# Altium project testjig-v1.PrjPcb
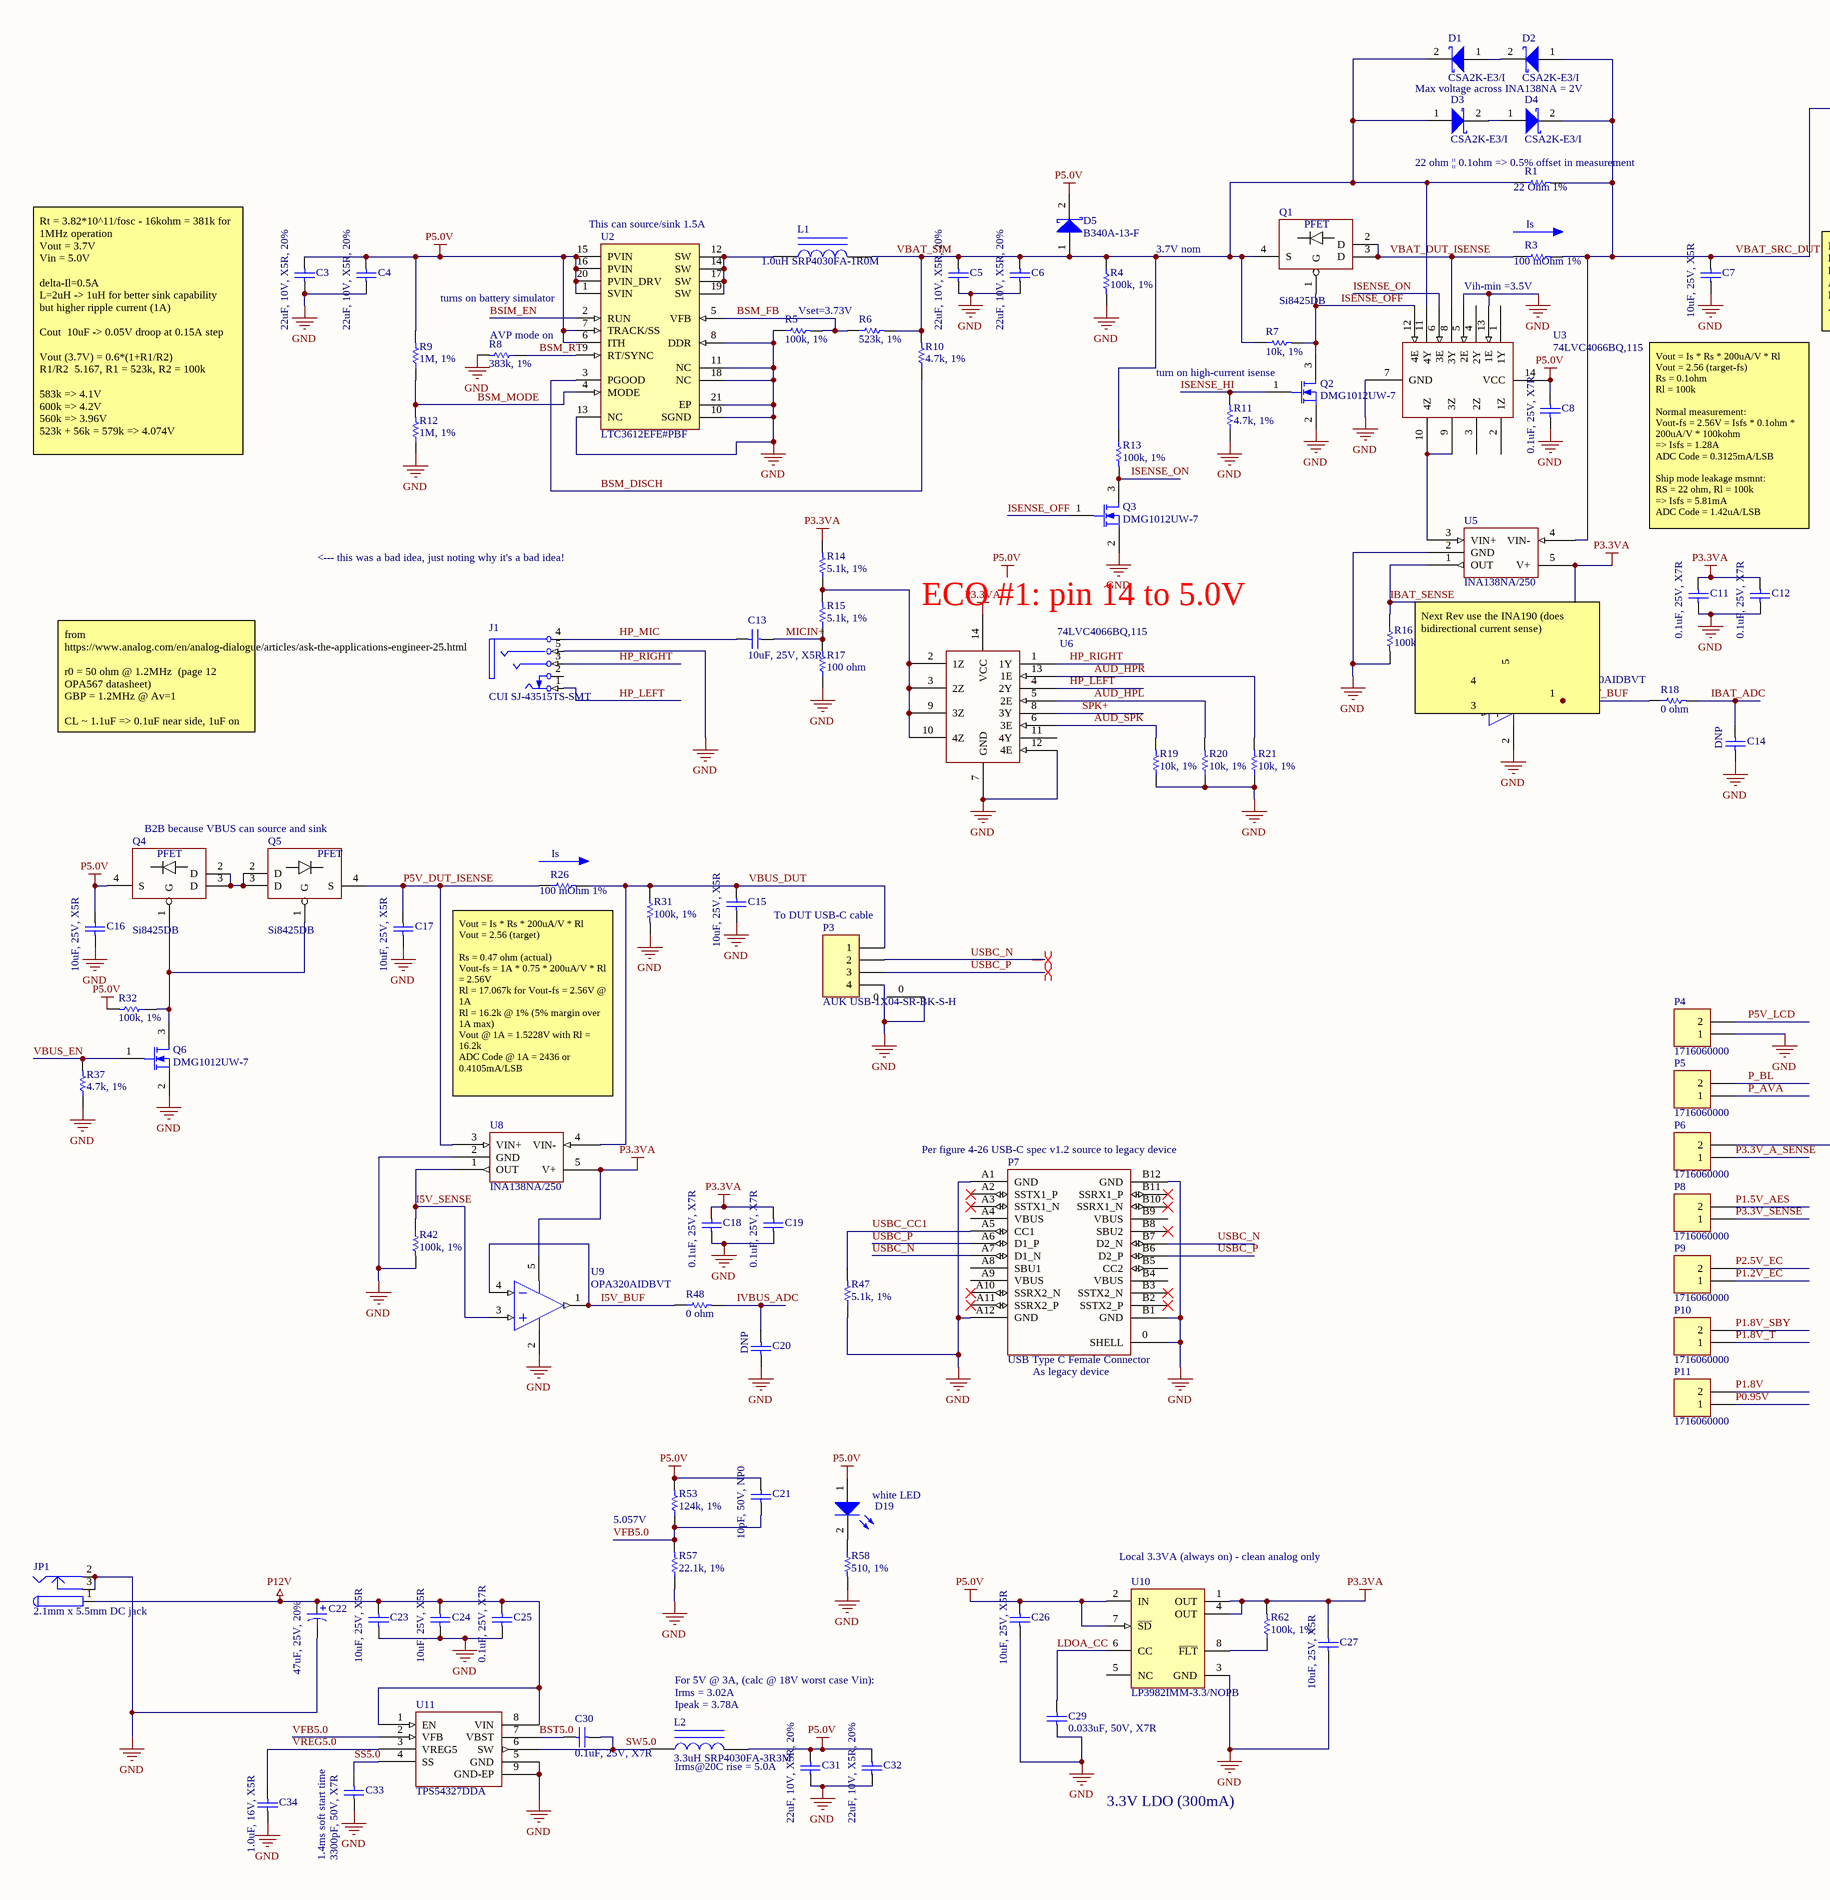
[diagram p0: testcore.SchDoc, left]
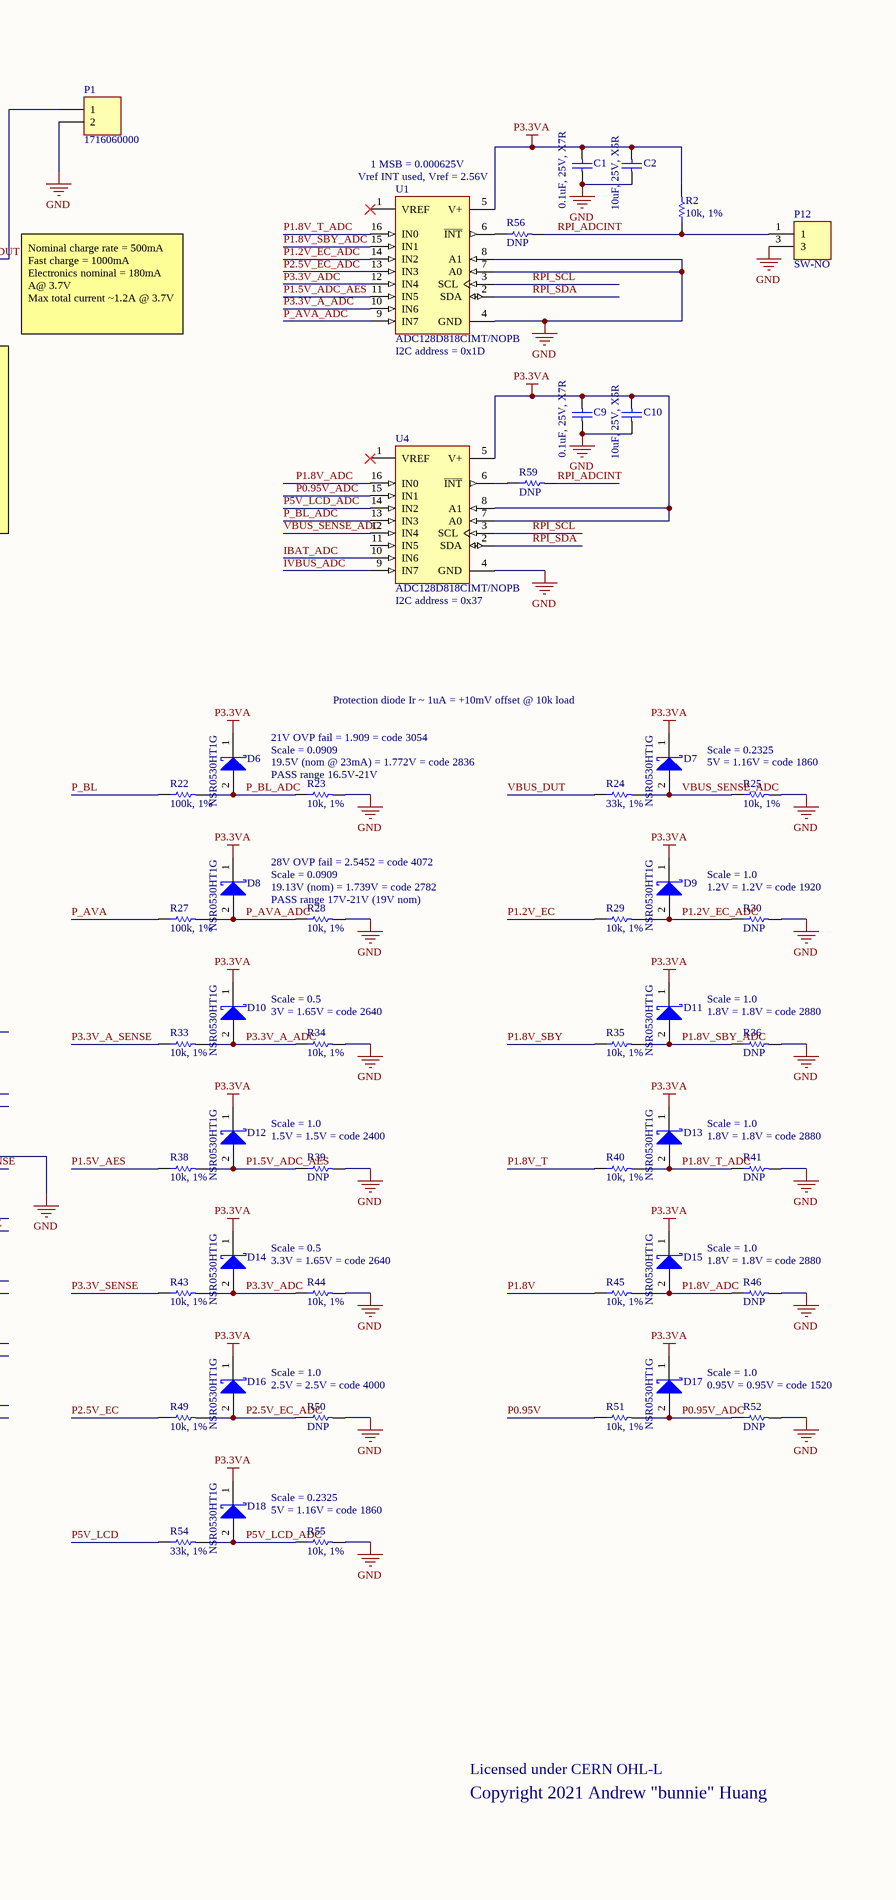
[diagram p1: testcore.SchDoc, right]
2 sheets, 192 parts. Net scope: global (net labels, ports and power ports of the same name join across sheets).
Board file: testjig-v1.PCBDOC
Sheets:
  testcore.SchDoc
  interfaces.SchDoc

## Sheet testcore.SchDoc
size A2

### Parts
C1  0.1uF, 25V, X7R  [B_CAP0603]
C2  10uF, 25V, X5R  [B_CAP0805]
C3  22uF, 10V, X5R, 20%  [B_CAP0805]
C4  22uF, 10V, X5R, 20%  [B_CAP0805]
C5  22uF, 10V, X5R, 20%  [B_CAP0805]
C6  22uF, 10V, X5R, 20%  [B_CAP0805]
C7  10uF, 25V, X5R  [B_CAP0805]
C8  0.1uF, 25V, X7R  [B_CAP0603]
C9  0.1uF, 25V, X7R  [B_CAP0603]
C10  10uF, 25V, X5R  [B_CAP0805]
C11  0.1uF, 25V, X7R  [B_CAP0603]
C12  0.1uF, 25V, X7R  [B_CAP0603]
C13  10uF, 25V, X5R  [B_CAP0805]
C14  DNP  [B_CAP0603]
C15  10uF, 25V, X5R  [B_CAP0805]
C16  10uF, 25V, X5R  [B_CAP0805]
C17  10uF, 25V, X5R  [B_CAP0805]
C18  0.1uF, 25V, X7R  [B_CAP0603]
C19  0.1uF, 25V, X7R  [B_CAP0603]
C20  DNP  [B_CAP0603]
C21  10pF, 50V, NP0  [B_CAP0603]
C22  47uF, 25V, 20%  [CAPAE7066X61N]
C23  10uF, 25V, X5R  [B_CAP0805]
C24  10uF, 25V, X5R  [B_CAP0805]
C25  0.1uF, 25V, X7R  [B_CAP0603]
C26  10uF, 25V, X5R  [B_CAP0805]
C27  10uF, 25V, X5R  [B_CAP0805]
C29  0.033uF, 50V, X7R  [B_CAP0603]
C30  0.1uF, 25V, X7R  [B_CAP0603]
C31  22uF, 10V, X5R, 20%  [B_CAP0805]
C32  22uF, 10V, X5R, 20%  [B_CAP0805]
C33  3300pF, 50V, X7R  [B_CAP0603]
C34  1.0uF, 16V, X5R  [B_CAP0603]
D1  CSA2K-E3/I  [DSO-C2/X1.8]
D2  CSA2K-E3/I  [DSO-C2/X1.8]
D3  CSA2K-E3/I  [DSO-C2/X1.8]
D4  CSA2K-E3/I  [DSO-C2/X1.8]
D5  B340A-13-F  [DSO-C2/X1.8]
D6  NSR0530HT1G  [SOD-323]
D7  NSR0530HT1G  [SOD-323]
D8  NSR0530HT1G  [SOD-323]
D9  NSR0530HT1G  [SOD-323]
D10  NSR0530HT1G  [SOD-323]
D11  NSR0530HT1G  [SOD-323]
D12  NSR0530HT1G  [SOD-323]
D13  NSR0530HT1G  [SOD-323]
D14  NSR0530HT1G  [SOD-323]
D15  NSR0530HT1G  [SOD-323]
D16  NSR0530HT1G  [SOD-323]
D17  NSR0530HT1G  [SOD-323]
D18  NSR0530HT1G  [SOD-323]
D19  white LED  [B_LED0805]
J1  CUI SJ-43515TS-SMT  [CUI_SJ_43515TS-SMT]
JP1  2.1mm x 5.5mm DC jack  [CUI_PJ_002AH_SMT]
L1  1.0uH SRP4030FA-1R0M  [COILCRAFT_XEL4030]
L2  3.3uH SRP4030FA-3R3M  [COILCRAFT_XEL4030]
P1  1716060000  [weidmuller_1716060000]
P3  AUK USB-1X04-SR-BK-S-H  [USB_TYPEA_TH_SINGLE]
P4  1716060000  [weidmuller_1716060000]
P5  1716060000  [weidmuller_1716060000]
P6  1716060000  [weidmuller_1716060000]
P7  USB Type C Female Connector  [HIROSE_CX90B1-24P]
P8  1716060000  [weidmuller_1716060000]
P9  1716060000  [weidmuller_1716060000]
P10  1716060000  [weidmuller_1716060000]
P11  1716060000  [weidmuller_1716060000]
P12  SW-NO  [CK_KS11R22CQD]
Q1  Si8425DB  [VISHAY_MICRO_FOOT_4_BUMP]
Q2  DMG1012UW-7  [SOT323-3AN]
Q3  DMG1012UW-7  [SOT323-3AN]
Q4  Si8425DB  [VISHAY_MICRO_FOOT_4_BUMP]
Q5  Si8425DB  [VISHAY_MICRO_FOOT_4_BUMP]
Q6  DMG1012UW-7  [SOT323-3AN]
R1  22 Ohm 1%  [B_RES1206]
R2  10k, 1%  [B_RES0603]
R3  100 mOhm 1%  [B_RES1206]
R4  100k, 1%  [B_RES0603]
R5  100k, 1%  [B_RES0603]
R6  523k, 1%  [B_RES0603]
R7  10k, 1%  [B_RES0603]
R8  383k, 1%  [B_RES0603]
R9  1M, 1%  [B_RES0603]
R10  4.7k, 1%  [B_RES0603]
R11  4.7k, 1%  [B_RES0603]
R12  1M, 1%  [B_RES0603]
R13  100k, 1%  [B_RES0603]
R14  5.1k, 1%  [B_RES0603]
R15  5.1k, 1%  [B_RES0603]
R16  100k, 1%  [B_RES0603]
R17  100 ohm  [B_RES0603]
R18  0 ohm  [B_RES0603]
R19  10k, 1%  [B_RES0603]
R20  10k, 1%  [B_RES0603]
R21  10k, 1%  [B_RES0603]
R22  100k, 1%  [B_RES0603]
R23  10k, 1%  [B_RES0603]
R24  33k, 1%  [B_RES0603]
R25  10k, 1%  [B_RES0603]
R26  100 mOhm 1%  [B_RES1206]
R27  100k, 1%  [B_RES0603]
R28  10k, 1%  [B_RES0603]
R29  10k, 1%  [B_RES0603]
R30  DNP  [B_RES0603]
R31  100k, 1%  [B_RES0603]
R32  100k, 1%  [B_RES0603]
R33  10k, 1%  [B_RES0603]
R34  10k, 1%  [B_RES0603]
R35  10k, 1%  [B_RES0603]
R36  DNP  [B_RES0603]
R37  4.7k, 1%  [B_RES0603]
R38  10k, 1%  [B_RES0603]
R39  DNP  [B_RES0603]
R40  10k, 1%  [B_RES0603]
R41  DNP  [B_RES0603]
R42  100k, 1%  [B_RES0603]
R43  10k, 1%  [B_RES0603]
R44  10k, 1%  [B_RES0603]
R45  10k, 1%  [B_RES0603]
R46  DNP  [B_RES0603]
R47  5.1k, 1%  [B_RES0603]
R48  0 ohm  [B_RES0603]
R49  10k, 1%  [B_RES0603]
R50  DNP  [B_RES0603]
R51  10k, 1%  [B_RES0603]
R52  DNP  [B_RES0603]
R53  124k, 1%  [B_RES0603]
R54  33k, 1%  [B_RES0603]
R55  10k, 1%  [B_RES0603]
R56  DNP  [B_RES0603]
R57  22.1k, 1%  [B_RES0603]
R58  510, 1%  [B_RES0603]
R59  DNP  [B_RES0603]
R62  100k, 1%  [B_RES0603]
U1  ADC128D818CIMT/NOPB  [MTC16_N]
U2  LTC3612EFE#PBF  [LT-FE-20-EPV-CB_L]
U3  74LVC4066BQ,115  [NXP_DHVQFN14]
U4  ADC128D818CIMT/NOPB  [MTC16_N]
U5  INA138NA/250  [SOT23-5AN]
U6  74LVC4066BQ,115  [NXP_DHVQFN14]
U7  OPA320AIDBVT  [TI-DBV5_N]
U8  INA138NA/250  [SOT23-5AN]
U9  OPA320AIDBVT  [TI-DBV5_N]
U10  LP3982IMM-3.3/NOPB  [MUA08A_N]
U11  TPS54327DDA  [SOIC127P600-8DN]

### Nets
GND: C1.2 C2.2 C3.2 C4.2 C5.2 C6.2 C7.1 C8.2 C9.2 C10.2 C11.2 C12.2 C14.2 C15.1 C16.1 C17.1 C18.2 C19.2 C20.2 C22.2 C23.1 C24.1 C25.2 C26.2 C27.2 C29.1 C31.2 C32.2 C33.2 C34.2 J1.5(R) JP1.2 JP1.3 P1.2 P3.0 P3.4 P4.1 P6.2 P7.0(SHELL) P7.A1(GND) P7.A12(GND) P7.B1(GND) P7.B12(GND) P12.3 Q2.2(S) Q3.2(S) Q6.2(S) R4.2 R5.1 R8.2 R11.1 R12.1 R16.2 R17.1 R19.1 R20.1 R21.1 R23.2 R25.2 R28.2 R30.2 R31.2 R34.2 R36.2 R37.1 R39.2 R41.2 R42.2 R44.2 R46.2 R47.1 R50.2 R52.2 R55.2 R57.1 R58.2 U1.4(GND) U1.7(A0) U1.8(A1) U2.8(DDR) U2.10(SGND) U2.11(NC) U2.13(NC) U2.18(NC) U2.21(EP) U3.5(2E) U3.7(GND) U3.13(1E) U4.4(GND) U5.2(GND) U6.7(GND) U6.12(4E) U7.2(V-) U8.2(GND) U9.2(V-) U10.3(GND) U11.5(GND) U11.9(GND-EP)
P1.8V: P11.2 R45.1
P1.8V_T: P10.1 R40.1
P3.3VA: C1.1 C2.1 C9.1 C10.1 C11.1 C12.1 C18.1 C19.1 C27.1 D6.1(K) D7.1(K) D8.1(K) D9.1(K) D10.1(K) D11.1(K) D12.1(K) D13.1(K) D14.1(K) D15.1(K) D16.1(K) D17.1(K) D18.1(K) R2.2 R14.2 R62.2 U1.5(V+) U4.5(V+) U4.7(A0) U4.8(A1) U5.5(V+) U6.14(VCC) U7.5(V+) U8.5(V+) U9.5(V+) U10.1(OUT) U10.4(OUT)
P5.0V: C3.1 C4.1 C8.1 C16.2 C21.1 C26.1 C31.1 C32.1 D5.2(K) D19.1(A) L2.2 Q4.4(S) R9.2 R32.2 R53.2 U2.1(SVIN) U2.6(ITH) U2.7(TRACK/SS) U2.15(PVIN) U2.16(PVIN) U2.20(PVIN_DRV) U3.14(VCC) U10.2(IN) U10.7(~{SD})
P12V: C22.1 C23.2 C24.2 C25.1 JP1.1 U11.1(EN) U11.8(VIN)
AUD_HPL: R20.2 U6.5(2E)
AUD_HPR: R21.2 U6.13(1E)
AUD_SPK: R19.2 U6.6(3E)
BSIM_EN: U2.2(RUN)
BSM_DISCH: R10.1 U2.3(PGOOD)
BSM_FB: R5.2 R6.1 U2.5(VFB)
BSM_MODE: R9.1 R12.2 U2.4(MODE)
BSM_RT: R8.1 U2.9(RT/SYNC)
BST5.0: C30.2 U11.7(VBST)
HP_LEFT: J1.1(T) U6.4(2Y)
HP_MIC: C13.2 J1.4(S)
HP_RIGHT: J1.3(R) U6.1(1Y)
I5V_BUF: R48.1 U9.1(OUT) U9.4(IN-)
I5V_SENSE: R42.1 U8.1(OUT) U9.3(IN+)
IBAT_ADC: C14.1 R18.2 U4.10(IN6)
IBAT_BUF: R18.1 U7.1(OUT) U7.4(IN-)
IBAT_SENSE: R16.1 U5.1(OUT) U7.3(IN+)
ISENSE_HI: Q2.1(G) R11.2
ISENSE_OFF: Q1.1(G) Q2.3(D) Q3.1(G) R7.2 U3.12(4E)
ISENSE_ON: Q3.3(D) R13.2 U3.6(3E)
IVBUS_ADC: C20.1 R48.2 U4.9(IN7)
LDOA_CC: C29.2 U10.6(CC)
MICIN+: C13.1 R15.1 R17.2
P0.95V: P11.1 R51.1
P0.95V_ADC: D17.2(A) R51.2 R52.1 U4.15(IN1)
P1.2V_EC: P9.1 R29.1
P1.2V_EC_ADC: D9.2(A) R29.2 R30.1 U1.14(IN2)
P1.5V_ADC_AES: D12.2(A) R38.2 R39.1 U1.11(IN5)
P1.5V_AES: P8.2 R38.1
P1.8V_ADC: D15.2(A) R45.2 R46.1 U4.16(IN0)
P1.8V_SBY: P10.2 R35.1
P1.8V_SBY_ADC: D11.2(A) R35.2 R36.1 U1.15(IN1)
P1.8V_T_ADC: D13.2(A) R40.2 R41.1 U1.16(IN0)
P2.5V_EC: P9.2 R49.1
P2.5V_EC_ADC: D16.2(A) R49.2 R50.1 U1.13(IN3)
P3.3V_A_ADC: D10.2(A) R33.2 R34.1 U1.10(IN6)
P3.3V_A_SENSE: P6.1 R33.1
P3.3V_ADC: D14.2(A) R43.2 R44.1 U1.12(IN4)
P3.3V_SENSE: P8.1 R43.1
P5V_DUT_ISENSE: C17.2 Q5.4(S) R26.1 U8.3(VIN+)
P5V_LCD: P4.2 R54.1
P5V_LCD_ADC: D18.2(A) R54.2 R55.1 U4.14(IN2)
P_AVA: P5.1 R27.1
P_AVA_ADC: D8.2(A) R27.2 R28.1 U1.9(IN7)
P_BL: P5.2 R22.1
P_BL_ADC: D6.2(A) R22.2 R23.1 U4.13(IN3)
RPI_ADCINT: P12.1 R2.1 R56.2 R59.2
RPI_SCL: U1.3(SCL) U4.3(SCL)
RPI_SDA: U1.2(SDA) U4.2(SDA)
SPK+: U6.8(3Y)
SS5.0: C33.1 U11.4(SS)
SW5.0: C30.1 L2.1 U11.6(SW)
USBC_CC1: P7.A5(CC1) R47.2
USBC_N: P3.2 P7.A7(D1_N) P7.B7(D2_N)
USBC_P: P3.3 P7.A6(D1_P) P7.B6(D2_P)
VBAT_DUT_ISENSE: Q1.2(D) Q1.3(D) R3.1 U3.8(3Y)
VBAT_SIM: C5.1 C6.1 D1.2(K) D3.1(A) D5.1(A) L1.2 Q1.4(S) R1.1 R4.1 R6.2 R7.1 R10.2 R13.1 U3.11(4Y)
VBAT_SRC_DUT: C7.2 D2.1(A) D4.2(K) P1.1 R1.2 R3.2 U5.4(VIN-)
VBUS_DUT: C15.2 P3.1 R24.1 R26.2 R31.1 U8.4(VIN-)
VBUS_EN: Q6.1(G) R37.2
VBUS_SENSE_ADC: D7.2(A) R24.2 R25.1 U4.12(IN4)
VFB5.0: C21.2 R53.1 R57.2 U11.2(VFB)
VREG5.0: C34.1 U11.3(VREG5)
NetD1_1: D1.1(A) D2.2(K)
NetD3_2: D3.2(K) D4.1(A)
NetD19_2: D19.2(K) R58.1
NetL1_1: L1.1 U2.12(SW) U2.14(SW) U2.17(SW) U2.19(SW)
NetQ4_1: Q4.1(G) Q5.1(G) Q6.3(D) R32.1
NetQ4_2: Q4.2(D) Q4.3(D) Q5.2(D) Q5.3(D)
NetR14_1: R14.1 R15.2 U6.2(1Z) U6.3(2Z) U6.9(3Z) U6.10(4Z)
NetR56_1: R56.1 U1.6(~{INT})
NetR59_1: R59.1 U4.6(~{INT})
NetR62_1: R62.1 U10.8(~{FLT})
NetU3_9: U3.9(3Z) U3.10(4Z) U5.3(VIN+)

Not connected (* = marked no-connect by the designer): J1 2(TN); P7 A2(SSTX1_P)* A3(SSTX1_N)* A4(VBUS) A8(SBU1) A9(VBUS) A10(SSRX2_N)* A11(SSRX2_P)* B2(SSTX2_P)* B3(SSTX2_N)* B4(VBUS) B5(CC2) B8(SBU2)* B9(VBUS) B10(SSRX1_N)* B11(SSRX1_P)*; U1 1(VREF)*; U3 1(1Y) 2(1Z) 3(2Z) 4(2Y); U4 1(VREF)* 11(IN5); U6 11(4Y); U10 5(NC)

### Layout directives
differential pair: USBC_N, USBC_P

### Notes on the sheet
- Max voltage across INA138NA = 2V
- (near R1) 22 ohm || 0.1ohm => 0.5% offset in measurement
- (near U1) Vref INT used, Vref = 2.56V
- (near U1) 1 MSB = 0.000625V
- (near U2) This can source/sink 1.5A
- 3.7V nom
- Is
- (near U2) turns on battery simulator
- (near R8) AVP mode on
- Vset=3.73V
- (near R3) Vih-min =3.5V
- Nominal charge rate = 500mA
  Fast charge = 1000mA
  Electronics nominal = 180mA A@ 3.7V
  Max total current ~1.2A @ 3.7V
- (near Q2) turn on high-current isense
- (near U1) I2C address = 0x1D
- Rt = 3.82*10^11/fosc - 16kohm = 381k for 1MHz operation
  Vout = 3.7V
  Vin = 5.0V
  delta-Il=0.5A
  L=2uH -> 1uH for better sink capability
  but higher ripple current (1A)
  Cout  10uF -> 0.05V droop at 0.15A step
  Vout (3.7V) = 0.6*(1+R1/R2)
  R1/R2  5.167, R1 = 523k, R2 = 100k
  583k => 4.1V
  600k => 4.2V
  560k => 3.96V
  523k + 56k = 579k => 4.074V
- Vout = Is * Rs * 200uA/V * Rl
  Vout = 2.56 (target-fs)
  Rs = 0.1ohm
  Rl = 100k
  Normal measurement:
  Vout-fs = 2.56V = Isfs * 0.1ohm * 200uA/V * 100kohm
  => Isfs = 1.28A
  ADC Code = 0.3125mA/LSB
  Ship mode leakage msmnt:
  RS = 22 ohm, Rl = 100k
  => Isfs = 5.81mA
  ADC Code = 1.42uA/LSB
- <--- this was a bad idea, just noting why it's a bad idea!
- ECO #1: pin 14 to 5.0V
- (near U4) I2C address = 0x37
- (near U7) Next Rev use the INA190 (does bidirectional current sense)
- Protection diode Ir ~ 1uA = +10mV offset @ 10k load
- from https://www.analog.com/en/analog-dialogue/articles/ask-the-applications-engineer-25.html
  r0 = 50 ohm @ 1.2MHz  (page 12 OPA567 datasheet)
  GBP = 1.2MHz @ Av=1
  CL ~ 1.1uF => 0.1uF near side, 1uF on Precursor
  fp = 1/(2pi*r0*CL) ~ 2895Hz
  10*(GBP/Anoise) < fp
  Anoise ~ 4144
  RF=10k, RG=10k, Asig = 2
  Anoise = 1 + Rf / (RG || RD) -> RG||RD = 2.41 ohm -> RD ~ 2.4 ohm
  CD ~ 2200uF
- Scale = 0.0909
- 19.5V (nom @ 23mA) = 1.772V = code 2836
- 21V OVP fail = 1.909 = code 3054
- (near R23) PASS range 16.5V-21V
- Scale = 0.2325
- 5V = 1.16V = code 1860
- B2B because VBUS can source and sink
- (near R26) Is
- 19.13V (nom) = 1.739V = code 2782
- 28V OVP fail = 2.5452 = code 4072
- (near R28) PASS range 17V-21V (19V nom)
- Scale = 1.0
- 1.2V = 1.2V = code 1920
- To DUT USB-C cable
- Scale = 0.5
- 3V = 1.65V = code 2640
- 1.8V = 1.8V = code 2880
- Vout = Is * Rs * 200uA/V * Rl
  Vout = 2.56 (target)
  Rs = 0.47 ohm (actual)
  Vout-fs = 1A * 0.75 * 200uA/V * Rl = 2.56V
  Rl = 17.067k for Vout-fs = 2.56V @ 1A
  Rl = 16.2k @ 1% (5% margin over 1A max)
  Vout @ 1A = 1.5228V with Rl = 16.2k
  ADC Code @ 1A = 2436 or 0.4105mA/LSB
- 1.5V = 1.5V = code 2400
- (near P7) Per figure 4-26 USB-C spec v1.2 source to legacy device
- 3.3V = 1.65V = code 2640
- (near P7) As legacy device
- 2.5V = 2.5V = code 4000
- 0.95V = 0.95V = code 1520
- 5.057V
- Local 3.3VA (always on) - clean analog only
- Irms = 3.02A
- For 5V @ 3A, (calc @ 18V worst case Vin):
- (near L2) Ipeak = 3.78A
- Licensed under CERN OHL-L
- (near L2) Irms@20C rise = 5.0A
- 3.3V LDO (300mA)
- Copyright 2021 Andrew "bunnie" Huang
- (near C33) 1.4ms soft start time
- Labels drawn without touching a wire or pin: P5.0V
- (in symbol Si8425DB) PFET

### Library data of the parts
C1 C8 C9 C11 C12 C18 C19 C25 C30 = Cap Semi: Capacitor (Semiconductor SIM Model); MPN: CC0603KRX7R8BB104; VENDOR: Murata; MYPN: C-104-25-X7R-0603
C2 C7 C10 C13 C15-C17 C23 C24 C26 C27 = Cap Semi: Capacitor (Semiconductor SIM Model); MPN: GRM21BR61E106KA73L; VENDOR: Murata; MYPN: C-106-25-X5R-0805
C3-C6 C31 C32 = Cap Semi: Capacitor (Semiconductor SIM Model); MPN: GRM21BR61A226ME51L; MFG: Murata; MYPN: C-226-10-X5R-0805; Published: 8-Jun-2000; LatestRevisionDate: 17-Jul-2002; LatestRevisionNote: Re-released for DXP Platform.; PackageReference: C1206; Publisher: Altium Limited
C14 C20 = Cap Semi: Capacitor (Semiconductor SIM Model); VENDOR: None; MPN: DNP; MYPN: DNP
C21 = Cap Semi: Capacitor (Semiconductor SIM Model); MPN: CL10C100JB8NFNC; VENDOR: Samsung; MYPN: C-100-50-NP0-0603
C22 = Cap Pol1: Polarized Capacitor (Radial); MPN: UCL1E470MCL1GS; VENDOR: Nichicon; MYPN: C-476-25-UCL-6.3x5.8
C29 = Cap Semi: Capacitor (Semiconductor SIM Model); MPN: CL10B333KB8NNNC; VENDOR: Samsung; MYPN: C-333-50-X7R-0603
C33 = Cap Semi: Capacitor (Semiconductor SIM Model); MPN: CL10B332KB8NNNC; VENDOR: Samsung; MYPN: C-332-50-X7R-0603
C34 = Cap Semi: Capacitor (Semiconductor SIM Model); MPN: CL10B105MO8NNWC; VENDOR: Samsung; MYPN: C-105-16-X5R-0603
D1-D4 = D Schottky: Schottky Diode; VENDOR: Vishay; MYPN: D-S-2-800-0p9-SMA; Revision: July-2002: Re-released for DXP Platform.; MPN: CSA2K-E3/I
D5 = D Schottky: Schottky Diode; VENDOR: Diodes Inc; MYPN: D-S-3-40-0p5-SMA; Revision: July-2002: Re-released for DXP Platform.; MPN: B340A-13-F
D6-D18 = D Schottky: Schottky Diode; MPN: NSR0530H-D; VENDOR: Semtech HK LTD; MYPN: D-S-0p5-30-0p37-SOD323; Revision: July-2002: Re-released for DXP Platform.
D19 = LED2: Typical RED, GREEN, YELLOW, AMBER GaAs LED; MPN: IN-S85AT5UW; VENDOR: Inolux; MYPN: D-LED-WHITE1-0805
J1 = Phonejack4 TN: Jack Socket, 3.5mm, SMT, 4-conductor; PackageDocument: 2003; PCB_Layout: Complies with manufacturer's recommendation.; DrillAndSlotSize: Corresponds to nominal value.; Published: 15-Jul-2004; DatasheetDocument: 2003; PackageReference: S1VS_SSB; Publisher: Altium Limited; ComponentLink1Description: Manufacturer Link; ComponentLink1URL: http://www.cliffuk.co.uk/; MPN: SJ-43515TS-SMT; VENDOR: CUI; MYPN: SJ-43515TS-SMT
JP1 = PWR2.5: Low Voltage Power Supply Connector; MPN: DC-480-2.0A-SMT; MYPN: J-PJ-002AH-SMT-TR; VENDOR: KAWEEI; Published: 17-Dec-2003; Datasheet: Latest Revision: 09-May-2002; Publisher: Altium Limited
L1 = Inductor Iron: Magnetic-Core Inductor; VENDOR: Bourns, Inc; MYPN: L-XEL4030-332ME_; MPN: SRP4030FA-1R0M
L2 = Inductor Iron: Magnetic-Core Inductor; MPN: XEL4030-332ME_; VENDOR: COILCRAFT; MYPN: L-XEL4030-332ME_
P1 P4-P6 P8-P11 = Header 2: Header, 2-Pin; VENDOR: Weidmuller; MYPN: J-TB-2P-5.08; LatestRevisionDate: 17-Jul-2002; LatestRevisionNote: Re-released for DXP Platform.; Publisher: Altium Limited; MPN: 1716060000
P3 = Header 4: Header, 4-Pin; LatestRevisionDate: 17-Jul-2002; LatestRevisionNote: Re-released for DXP Platform.; Publisher: Altium Limited
P7 = USB_TYPE_C: USB Type C Connector; MPN: 1-2295018-2; VENDOR: TE Connectivity AMP Connectors; MYPN: P-1-2295018-2
P12 = Header 2: Header, 2-Pin; LatestRevisionDate: 17-Jul-2002; LatestRevisionNote: Re-released for DXP Platform.; Publisher: Altium Limited
Q1 Q4 Q5 = Si8425DB: P-channel 20V 6.2A 27mOhm @ -2.5V; MPN: Si8425DB-T1-E1; VENDOR: Vishay Siliconix; MYPN: QSi8525
Q2 Q3 Q6 = MOSFET-N: N-Channel MOSFET; VENDOR: Diodes Inc; MYPN: Q-DMG1012UW-7; Published: 8-Jun-2000; LatestRevisionDate: 17-Jul-2002; LatestRevisionNote: Re-released for DXP Platform.; PackageVersion: 1995/1996; PackageReference: E3; Publisher: Altium Limited; MPN: DMG1012UW-7
R1 = Res1: Resistor; MPN: ERJ-8ENF22R0V; VENDOR: Panasonic; MYPN: R-220-1P-1_4W-1206
R2 R7 R19-R21 R23 R25 R28 R29 R33-R35 R38 R40 R43-R45 R49 R51 R55 = Res1: Resistor; MPN: RC0603FR-0710KL; VENDOR: Yageo; MYPN: R-103-1P-1_16W-0603
R3 R26 = Res1: Resistor; MPN: CSR1206FTR100; VENDOR: Stackpole; MYPN: R-0R100-1P-1_2W-1206
R4 R5 R13 R16 R22 R27 R31 R32 R42 R62 = Res1: Resistor; MPN: RC0603FR-07100KL; VENDOR: Yageo; MYPN: R-104-1P-1_16W-0603
R6 = Res1: Resistor; MPN: RC0603FR-07523KL; VENDOR: Yageo; MYPN: R-5233-1P-1_16W-0603
R8 = Res1: Resistor; MPN: RC0603FR-07383KL; VENDOR: Yageo; MYPN: R-3833-1P-1_16W-0402
R9 R12 = Res1: Resistor; MPN: RC0603FR-071ML; VENDOR: Yageo; MYPN: R-105-1P-1_16W-0603
R10 R11 R37 = Res1: Resistor; MPN: RC0603FR-074K7L; VENDOR: Yageo; MYPN: R-472-1P-1_16W-0603
R14 R15 R47 = Res1: Resistor; MPN: RC0603FR-075K1L; VENDOR: Yageo; MYPN: R-512-1P-1_16W-0603
R17 = Res1: Resistor; MPN: RC0603FR-07100RL; VENDOR: Yageo; MYPN: R-101-1P-1_16W-0603
R18 R48 = Res1: Resistor; MPN: RC0603JR-070RL; VENDOR: Yageo; MYPN: R-0R0-1P-1_16W-0603
R24 R54 = Res1: Resistor; MPN: RC0603FR-0733KL; VENDOR: Yageo; MYPN: R-333-1P-1_16W-0603
R30 R36 R39 R41 R46 R50 R52 R56 R59 = Res1: Resistor; VENDOR: ANY; MYPN: DNP; MPN: ANY
R53 = Res1: Resistor; MPN: RC0603FR-07124KL; VENDOR: Yageo; MYPN: R-1243-1P-1_16W-0603
R57 = Res1: Resistor; MPN: RC0603FR-0722K1L; VENDOR: Yageo; MYPN: R-2212-1P-1_16W-0603
R58 = Res1: Resistor; MPN: RC0603FR-07510RL; Value: 100k; VENDOR: Yageo; MYPN: R-511-1P-1_16W-0603; Published: 8-Jun-2000; LatestRevisionDate: 17-Jul-2002; LatestRevisionNote: Re-released for DXP Platform.; PackageReference: AXIAL-0.3; Publisher: Altium Limited
U1 U4 = ADC128D818CIMT/NOPB: 12-Bit, 8-Channel, ADC System Monitor with Temperature Sensor, Internal/External Reference, and I2C Interface, 16 pin TSSOP, Pb-Free; Manufacturer: National Semiconductor; PackageTopMarking: NSUZXYTT*128D818*CIMT; PowerWise: N; CompType: ADC IC; High-Reliability: Y; VENDOR: TI; MYPN: U-ADC128D818CIMT/NOPB; DatasheetVersion: Feb-2010; PackageVersion: revD, Jun-2003; PackageReference: MTC16; PackageDescription: Molded TSSOP, Jedec, 5 x 4.4 x 0.9mm Body, 16 Lead, 0.65mm Pitch; PartNumber: ADC128D818CIMT/NOPB; RoHS: Y; PinCount: 16; Code_JEDEC: MO-153-AB; ComponentLink1Description: ADC128D818 Datasheet; ComponentLink1URL: http://www.national.com/ds/AD/ADC128D818.pdf; ComponentLink2Description: ADC128D818 Web Page; ComponentLink2URL: http://www.national.com/pf/AD/ADC128D818.html; ComponentLink3Description: MTC16 Package Page; ComponentLink3URL: http://www.national.com/packaging/folders/mtc16.html; MPN: ADC128D818CIMT/NOPB
U2 = CMP-0492-00542-1: 3 A, 4 MHz Monolithic Synchronous Step-Down DC/DC Converter, 20-pin SOP (FE-20-EPV-CB), -40 to 125 degC, Pb-Free; Number of Outputs: 1; Frequency Adjust Range: Up - 4MHz; VENDOR: Linear Technology; PackageVersion: Rev. I, 05/2011; ComponentLink3URL: http://cds.linear.com/docs/en/packaging/05081663__J_FE20(CB).pdf; ComponentLink1URL: http://www.linear.com/; MPN: LTC3612EFE#PBF; ComponentLink2Description: Datasheet; DatasheetVersion: Rev. A; ComponentLink1Description: Manufacturer URL; RoHS: TRUE; Mounting Technology: Surface Mount; PackageDescription: 20-Pin Plastic TSSOP, Body 6.5 x 4.4 mm, Pitch 0.65 mm; ComponentLink3Description: Package Specification; ComponentLink2URL: http://cds.linear.com/docs/en/datasheet/3612fa.pdf; PackageReference: FE-20
U3 U6 = 74LVC4066: Quad Bilateral Switch; MYPN: U-74LVC4066; VENDOR: NXP; MPN: 74LVC4066BQ,115
U5 U8 = INA138NA/250: High-side measurement current shunt monitor; VENDOR: TI; MYPN: U-INA138NA/250; MPN: INA138NA/250
U7 U9 = OPA320AIDBVT: Precision, 20 MHz, 0.9 pA Ib, RRIO, CMOS Operational Amplifier, 1.8 to 5.5 V, -40 to 125 degC, 5-pin SOT23 (DBV5), Green (RoHS & no Sb/Br); Manufacturer: Texas Instruments; CMRR(Min)(dB): 100; IIB(Max)(pA): 0.9; Iq per channel(Max)(mA): 1.75; Number of Channels: 2; Offset Drift(Typ)(uV/C): 1.5; Slew Rate(Typ)(V/us): 10; Sub Family: High Output Current Amplifier (>=50mA), Low Input Bias Current Amp (<=10pA), Low Noise Amp (<=10nV/rtHz), Low Offset Voltage Amplifier (<=500uV), Low Supply Voltage Amplifier (<=2.7V), Precision Amplifier; Total Supply Voltage(Max)(+5V is 5, +/-5V is 10): 5.5; Total Supply Voltage(Min)(+5V is 5, +/-5V is 10): 1.8; Vio (25C)(Max)(mV): 0.15; Vn at 1kHz(Typ)(nV/rtHz): 8.5; MYPN: U-OPA320AIDBVT; VENDOR: TI; DatasheetVersion: SBOS513D; PackageVersion: 4073253-4/K, 03/2006; PackageReference: DBV5; PackageDescription: 5-Pin Plastic Small Outline, Body 1.6 x 2.9 mm, Pitch 0.95 mm; Supplier 1: Digi-Key; Supplier Part Number 1: 296-29510-2-ND; Supplier 2: Digi-Key; Supplier Part Number 2: 296-29510-1-ND; Supplier 3: Digi-Key; Supplier Part Number 3: 296-29510-6-ND; Supplier 4: Farnell; Supplier Part Number 4: 2057093; Supplier 5: Newark; Supplier Part Number 5: 64T3763; Supplier 6: Newark; Supplier Part Number 6: 64T3764; Supplier 7: Mouser; Supplier Part Number 7: 595-OPA320AIDBVT; Eco-Plan: Green (RoHS & no Sb/Br); Mounting Technology: Surface Mount; Code_JEDEC: MO-178; PartNumber: OPA320AIDBVT; ComponentLink1Description: Manufacturer URL; ComponentLink1URL: http://www.ti.com/; ComponentLink2Description: Datasheet; ComponentLink2URL: http://www.ti.com/general/docs/lit/getliterature.tsp?genericPartNumber=OPA320&fileType=pdf; ComponentLink3Description: Package Specification; ComponentLink3URL: http://www.ti.com/litv/pdf/mpds018i; MPN: OPA320AIDBVT
U10 = LP3982IMM-3.3/NOPB: Micropower, Ultra Low-Dropout, Low-Noise, 300mA CMOS Regulator, 8-pin Mini SOIC, Pb-Free; Manufacturer: National Semiconductor; PackageTopMarking: ZXTT*LEUB; PowerWise: N; CompType: LDO IC; High-Reliability: Y; MYPN: ULP3982IMM-3.3/NOPB; VENDOR: TI; DatasheetVersion: Mar-2006; PackageVersion: revF, Apr-2008; PackageReference: MUA08A; PackageDescription: MINI SOIC, .118 x .118 x .034in, 8 Lead, .0256in Pitch; PartNumber: LP3982IMM-3.3/NOPB; RoHS: Y; PinCount: 8; Code_JEDEC: MO-187-AA; ComponentLink1Description: Manufacturer URL; ComponentLink1URL: http://www.national.com/; ComponentLink2Description: LP3982 Datasheet; ComponentLink2URL: http://www.national.com/ds/LP/LP3982.pdf; ComponentLink3Description: LP3982 Web Page; ComponentLink3URL: http://www.national.com/pf/LP/LP3982.html; ComponentLink4Description: MUA08A Package Page; ComponentLink4URL: http://www.national.com/packaging/folders/mua08a.html; MPN: LP3982IMM-3.3/NOPB
U11 = TPS54327DDA: 3-A Output Single Synchronous Step-Down Buck with Integrated FET; MPN: TPS54327DDA(R); MYPN: U-TPS54327DDA; VENDOR: TI

## Sheet interfaces.SchDoc
size C
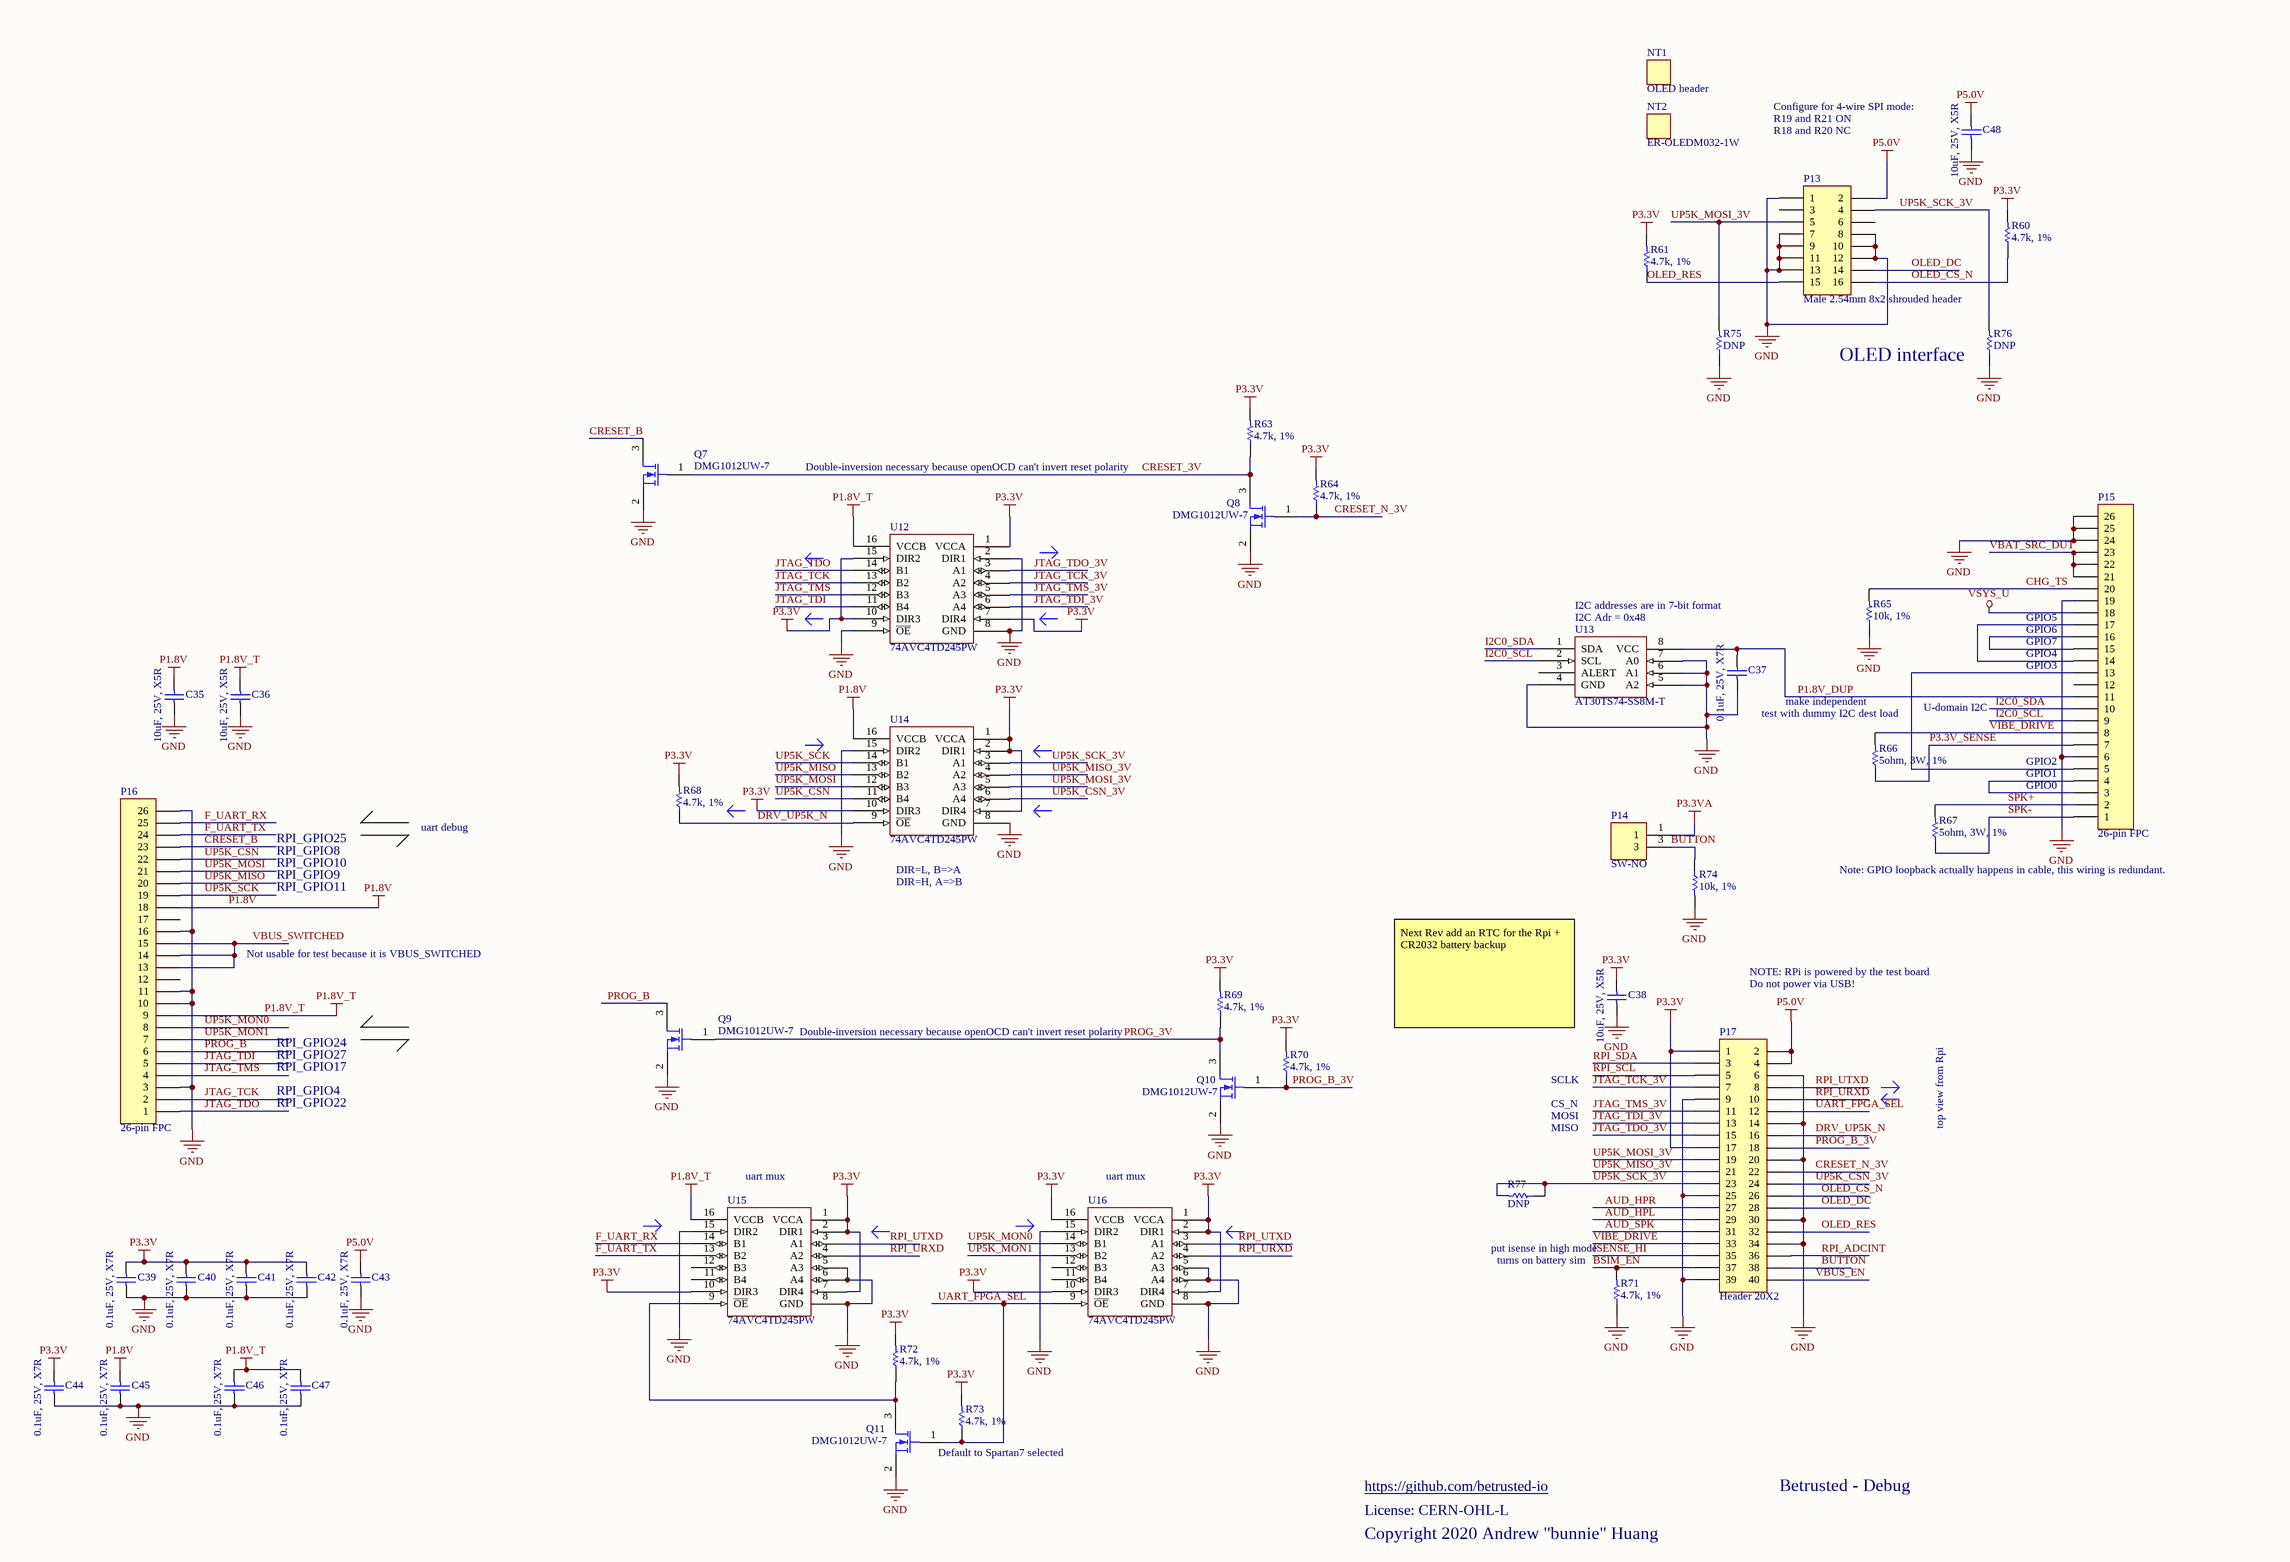
[diagram p2: interfaces.SchDoc]

### Parts
C35  10uF, 25V, X5R  [B_CAP0805]
C36  10uF, 25V, X5R  [B_CAP0805]
C37  0.1uF, 25V, X7R  [B_CAP0603]
C38  10uF, 25V, X5R  [B_CAP0805]
C39  0.1uF, 25V, X7R  [B_CAP0603]
C40  0.1uF, 25V, X7R  [B_CAP0603]
C41  0.1uF, 25V, X7R  [B_CAP0603]
C42  0.1uF, 25V, X7R  [B_CAP0603]
C43  0.1uF, 25V, X7R  [B_CAP0603]
C44  0.1uF, 25V, X7R  [B_CAP0603]
C45  0.1uF, 25V, X7R  [B_CAP0603]
C46  0.1uF, 25V, X7R  [B_CAP0603]
C47  0.1uF, 25V, X7R  [B_CAP0603]
C48  10uF, 25V, X5R  [B_CAP0805]
NT1  OLED header
NT2  ER-OLEDM032-1W
P13  Male 2.54mm 8x2 shrouded header  [ER_OLED_M032_1]
P14  SW-NO  [CK_KS11R22CQD]
P15  26-pin FPC  [HRS_FH34SRJ-26S-0.5SH(50)]
P16  26-pin FPC  [HRS_FH34SRJ-26S-0.5SH(50)]
P17  Header 20X2  [SAMTEC_SSW-120-01-F-D]
Q7  DMG1012UW-7  [SOT323-3AN]
Q8  DMG1012UW-7  [SOT323-3AN]
Q9  DMG1012UW-7  [SOT323-3AN]
Q10  DMG1012UW-7  [SOT323-3AN]
Q11  DMG1012UW-7  [SOT323-3AN]
R60  4.7k, 1%  [B_RES0603]
R61  4.7k, 1%  [B_RES0603]
R63  4.7k, 1%  [B_RES0603]
R64  4.7k, 1%  [B_RES0603]
R65  10k, 1%  [B_RES0603]
R66  5ohm, 3W, 1%  [OHMITE_43_3W]
R67  5ohm, 3W, 1%  [OHMITE_43_3W]
R68  4.7k, 1%  [B_RES0603]
R69  4.7k, 1%  [B_RES0603]
R70  4.7k, 1%  [B_RES0603]
R71  4.7k, 1%  [B_RES0603]
R72  4.7k, 1%  [B_RES0603]
R73  4.7k, 1%  [B_RES0603]
R74  10k, 1%  [B_RES0603]
R75  DNP  [B_RES0603]
R76  DNP  [B_RES0603]
R77  DNP  [B_RES0603]
U12  74AVC4TD245PW  [TSOP65P640-16AN]
U13  AT30TS74-SS8M-T  [SOIC127P600-8AN]
U14  74AVC4TD245PW  [TSOP65P640-16AN]
U15  74AVC4TD245PW  [TSOP65P640-16AN]
U16  74AVC4TD245PW  [TSOP65P640-16AN]

### Nets
GND: C35.2 C36.2 C37.2 C38.2 C39.2 C40.2 C41.2 C42.2 C43.2 C44.2 C45.2 C46.2 C47.2 C48.2 P13.1 P13.7 P13.8 P13.9 P13.10 P13.11 P13.12 P13.13 P15.6 P15.19 P15.24 P15.25 P15.26 P16.3 P16.10 P16.11 P16.16 P16.26 P17.6 P17.9 P17.14 P17.20 P17.25 P17.30 P17.34 P17.39 Q7.2(S) Q8.2(S) Q9.2(S) Q10.2(S) Q11.2(S) R65.1 R71.1 R74.2 R75.1 R76.1 U12.2(DIR1) U12.8(GND) U12.9(~{OE}) U13.4(GND) U13.5(A2) U13.6(A1) U13.7(A0) U14.8(GND) U14.15(DIR2) U15.5(A3) U15.6(A4) U15.8(GND) U15.15(DIR2) U16.5(A3) U16.6(A4) U16.8(GND) U16.15(DIR2)
P1.8V: C35.1 C45.1 P16.18 U14.16(VCCB)
P1.8V_T: C36.1 C46.1 C47.1 P16.9 U12.16(VCCB) U15.16(VCCB)
P3.3V: C38.1 C39.1 C40.1 C41.1 C42.1 C44.1 P17.1 P17.17 R60.2 R61.2 R63.2 R64.2 R68.2 R69.2 R70.2 R72.2 R73.2 U12.1(VCCA) U12.7(DIR4) U12.10(DIR3) U12.15(DIR2) U14.1(VCCA) U14.2(DIR1) U14.7(DIR4) U14.10(DIR3) U15.1(VCCA) U15.2(DIR1) U15.7(DIR4) U15.10(DIR3) U16.1(VCCA) U16.2(DIR1) U16.7(DIR4) U16.10(DIR3) U16.16(VCCB)
P3.3VA: P14.1
P5.0V: C43.1 C48.1 P13.2 P17.2 P17.4
VSYS_U: P15.18
AUD_HPL: P17.29
AUD_HPR: P17.27
AUD_SPK: P17.31
BSIM_EN: P17.37 R71.2
BUTTON: P14.3 P17.38 R74.1
CHG_TS: P15.20 R65.2
CRESET_3V: Q7.1(G) Q8.3(D) R63.1
CRESET_B: P16.23 Q7.3(D)
CRESET_N_3V: P17.22 Q8.1(G) R64.1
DRV_UP5K_N: P17.16 R68.1 U14.9(~{OE})
F_UART_RX: P16.25 U15.14(B1)
F_UART_TX: P16.24 U15.13(B2)
I2C0_SCL: P15.9 U13.2(SCL)
I2C0_SDA: P15.10 U13.1(SDA)
ISENSE_HI: P17.35
JTAG_TCK: P16.2 U12.13(B2)
JTAG_TCK_3V: P17.7 U12.4(A2)
JTAG_TDI: P16.5 U12.11(B4)
JTAG_TDI_3V: P17.13 U12.6(A4)
JTAG_TDO: P16.1 U12.14(B1)
JTAG_TDO_3V: P17.15 U12.3(A1)
JTAG_TMS: P16.4 U12.12(B3)
JTAG_TMS_3V: P17.11 U12.5(A3)
OLED_CS_N: P13.16 P17.26 R60.1
OLED_DC: P13.14 P17.28
OLED_RES: P13.15 P17.32 R61.1
P1.8V_DUP: C37.1 P15.11 U13.8(VCC)
P3.3V_SENSE: P15.7 R66.1
PROG_3V: Q9.1(G) Q10.3(D) R69.1
PROG_B: P16.6 Q9.3(D)
PROG_B_3V: P17.18 Q10.1(G) R70.1
RPI_ADCINT: P17.36
RPI_SCL: P17.5
RPI_SDA: P17.3
RPI_URXD: P17.10 U15.4(A2) U16.4(A2)
RPI_UTXD: P17.8 U15.3(A1) U16.3(A1)
SPK+: P15.2 R67.2
SPK-: P15.1 R67.1
UART_FPGA_SEL: P17.12 Q11.1(G) R73.1 U16.9(~{OE})
UP5K_CSN: P16.22 U14.11(B4)
UP5K_CSN_3V: P17.24 U14.6(A4)
UP5K_MISO: P16.20 U14.13(B2)
UP5K_MISO_3V: P17.21 U14.4(A2)
UP5K_MON0: P16.8 U16.14(B1)
UP5K_MON1: P16.7 U16.13(B2)
UP5K_MOSI: P16.21 U14.12(B3)
UP5K_MOSI_3V: P13.5 P17.19 R75.2 U14.5(A3)
UP5K_SCK: P16.19 U14.14(B1)
UP5K_SCK_3V: P13.4 P17.23 R76.2 R77.1 R77.2 U14.3(A1)
VBAT_SRC_DUT: P15.21 P15.22 P15.23
VBUS_EN: P17.40
VBUS_SWITCHED: P16.13 P16.14 P16.15
VIBE_DRIVE: P15.8 P17.33 R66.2
NetP15_3: P15.3 P15.4
NetP15_5: P15.5 P15.13
NetP15_14: P15.14 P15.17
NetP15_15: P15.15 P15.16
NetQ11_3: Q11.3(D) R72.1 U15.9(~{OE})

Not connected (* = marked no-connect by the designer): P13 3 6; P15 12; P16 12 17; U13 3(ALERT); U15 11(B4) 12(B3); U16 11(B4) 12(B3)

### Notes on the sheet
- (near C48) Configure for 4-wire SPI mode:
- R19 and R21 ON
- R18 and R20 NC
- (near R76) OLED interface
- Double-inversion necessary because openOCD can't invert reset polarity
- I2C addresses are in 7-bit format
- (near U13) I2C Adr = 0x48
- (near P15) GPIO4
- (near P15) GPIO5
- (near P15) GPIO6
- (near P15) GPIO7
- test with dummy I2C dest load
- make independent
- U-domain I2C
- (near P15) GPIO3
- (near P15) GPIO1
- (near P15) GPIO2
- uart debug
- (near P15) GPIO0
- RPI_GPIO10
- RPI_GPIO9
- RPI_GPIO11
- RPI_GPIO8
- RPI_GPIO25
- (near U14) DIR=L, B=>A
- DIR=H, A=>B
- (near R67) Note: GPIO loopback actually happens in cable, this wiring is redundant.
- Not usable for test because it is VBUS_SWITCHED
- (near C38) Next Rev add an RTC for the Rpi + CR2032 battery backup
- NOTE: RPi is powered by the test board
- Do not power via USB!
- RPI_GPIO17
- RPI_GPIO27
- RPI_GPIO24
- RPI_GPIO4
- RPI_GPIO22
- MOSI
- MISO
- SCLK
- CS_N
- top view from Rpi
- (near U15) uart mux
- (near U16) uart mux
- (near R71) put isense in high mode
- (near R71) turns on battery sim
- Default to Spartan7 selected
- https://github.com/betrusted-io
- Betrusted - Debug
- License: CERN-OHL-L
- Copyright 2020 Andrew "bunnie" Huang

### Library data of the parts
C35 C36 C38 C48 = Cap Semi: as C2 on sheet testcore
C37 C39-C47 = Cap Semi: as C1 on sheet testcore
NT1 = NOTE: Placeholder for non-board BOM items; MPN: PPPC082LFBN-RC; MYPN: NT-PPPC082LFBN-RC; VENDOR: Sullins
NT2 = NOTE: Placeholder for non-board BOM items; MYPN: NT-ER-OLEDM032-1W; VENDOR: East Rising; MPN: ER-OLEDM032-1W
P13 = Header 8X2: Header, 8-Pin, Dual row, shrouded; MPN: PRPC008DAAN-RC; MYPN: J-2.54MM-2x8-M-SHROUDED-RA; VENDOR: Sullins; LatestRevisionDate: 17-Jul-2002; LatestRevisionNote: Re-released for DXP Platform.; Publisher: Altium Limited
P14 = Header 2: Header, 2-Pin; LatestRevisionDate: 17-Jul-2002; LatestRevisionNote: Re-released for DXP Platform.; Publisher: Altium Limited
P15 = FPC-26: 26 Pin FPC header; MPN: FH34SRJ-26S-0.5SH(99); MYPN: J-FPC-0.5mm-26-0.3mm-T/B; VENDOR: Hirose; System: Connector
P16 = FPC-26: 26 Pin FPC header; MPN: FH34SRJ-26S-0.5SH(99); MYPN: J-FPC-0.5mm-26-0.3mm-T/B; VENDOR: Hirose
P17 = Header 20X2: Header, 20-Pin, Dual row; MPN: P-SSW-120-01-F-D; VENDOR: Samtec; LatestRevisionDate: 17-Jul-2002; LatestRevisionNote: Re-released for DXP Platform.; Publisher: Altium Limited
Q7-Q11 = MOSFET-N: as Q2 on sheet testcore; Published: 8-Jun-2000; LatestRevisionDate: 17-Jul-2002; LatestRevisionNote: Re-released for DXP Platform.; PackageVersion: 1995/1996; PackageReference: E3; Publisher: Altium Limited; MPN: DMG1012UW-7
R60 R61 R63 R64 R68-R73 = Res1: as R10 on sheet testcore
R65 R74 = Res1: as R2 on sheet testcore
R66 R67 = Res1: Resistor; MPN: 43F5R0E; VENDOR: Ohmite; MYPN: R-5R0-1P-3W-AXIAL15
R75-R77 = Res1: Resistor; VENDOR: ANY; MYPN: DNP; MPN: ANY
U12 U14-U16 = 74AVC4TD245: 4-bit dual supply translating transceiver with configurable voltage translation; 3-state; MYPN: U-74AVC4TD245PW; VENDOR: Nexperia; MPN: 74AVC4TD245PW
U13 = AT30TS74-SS8M-T: 9- to 12-bit Selectable, ±1.0°C Accurate Digital Temperature Sensor; MYPN: U-AT30TS74-SS8M-T; VENDOR: Atmel; MPN: AT30TS74-SS8M-T

## Nets that join several sheets
GND: testcore (98 pins), interfaces (67 pins)
P1.8V: testcore (P11.2 R45.1), interfaces (C35.1 C45.1 P16.18 U14.16)
P1.8V_T: testcore (P10.1 R40.1), interfaces (6 pins)
P3.3VA: testcore (36 pins), interfaces (P14.1)
P5.0V: testcore (24 pins), interfaces (5 pins)
AUD_HPL: testcore (R20.2 U6.5), interfaces (P17.29)
AUD_HPR: testcore (R21.2 U6.13), interfaces (P17.27)
AUD_SPK: testcore (R19.2 U6.6), interfaces (P17.31)
BSIM_EN: testcore (U2.2), interfaces (P17.37 R71.2)
ISENSE_HI: testcore (Q2.1 R11.2), interfaces (P17.35)
P3.3V_SENSE: testcore (P8.1 R43.1), interfaces (P15.7 R66.1)
RPI_ADCINT: testcore (P12.1 R2.1 R56.2 R59.2), interfaces (P17.36)
RPI_SCL: testcore (U1.3 U4.3), interfaces (P17.5)
RPI_SDA: testcore (U1.2 U4.2), interfaces (P17.3)
SPK+: testcore (U6.8), interfaces (P15.2 R67.2)
VBAT_SRC_DUT: testcore (7 pins), interfaces (P15.21 P15.22 P15.23)
VBUS_EN: testcore (Q6.1 R37.2), interfaces (P17.40)